# Altium schematic sheet Main1.1.SchDoc
size A2
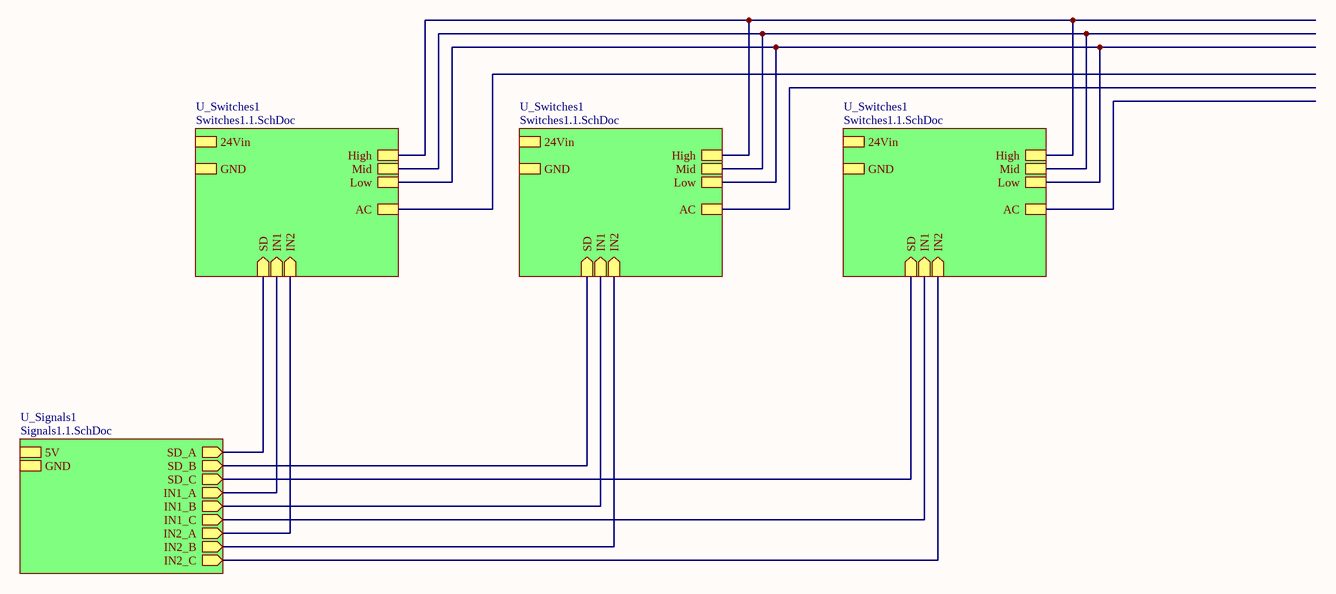
[diagram p0: Main1.1.SchDoc]

## Sub-sheets
U_Signals1 = Signals1.1.SchDoc: SD_A (out), SD_B (out), SD_C (out), IN1_A (out), IN1_B (out), IN1_C (out), IN2_A (out), IN2_B (out), IN2_C (out), 5V, GND
U_Switches1 = Switches1.1.SchDoc: High, Low, Mid, AC, SD (in), 24Vin, GND, IN1 (in), IN2 (in)
U_Switches1 = Switches1.1.SchDoc: High, Low, Mid, AC, SD (in), 24Vin, GND, IN1 (in), IN2 (in)
U_Switches1 = Switches1.1.SchDoc: High, Low, Mid, AC, SD (in), 24Vin, GND, IN1 (in), IN2 (in)

## Nets
(unnamed): sheet U_Switches1/High, sheet U_Switches1/High, sheet U_Switches1/High
(unnamed): sheet U_Switches1/Low, sheet U_Switches1/Low, sheet U_Switches1/Low
(unnamed): sheet U_Switches1/Mid, sheet U_Switches1/Mid, sheet U_Switches1/Mid
(unnamed): sheet U_Switches1/SD, sheet U_Signals1/SD_A
(unnamed): sheet U_Switches1/IN1, sheet U_Signals1/IN1_A
(unnamed): sheet U_Switches1/IN2, sheet U_Signals1/IN2_A
(unnamed): sheet U_Switches1/SD, sheet U_Signals1/SD_B
(unnamed): sheet U_Switches1/IN1, sheet U_Signals1/IN1_B
(unnamed): sheet U_Switches1/IN2, sheet U_Signals1/IN2_B
(unnamed): sheet U_Switches1/SD, sheet U_Signals1/SD_C
(unnamed): sheet U_Switches1/IN1, sheet U_Signals1/IN1_C
(unnamed): sheet U_Switches1/IN2, sheet U_Signals1/IN2_C